# EAGLE schematic Steckverbinder (EAGLE 7.4.0)
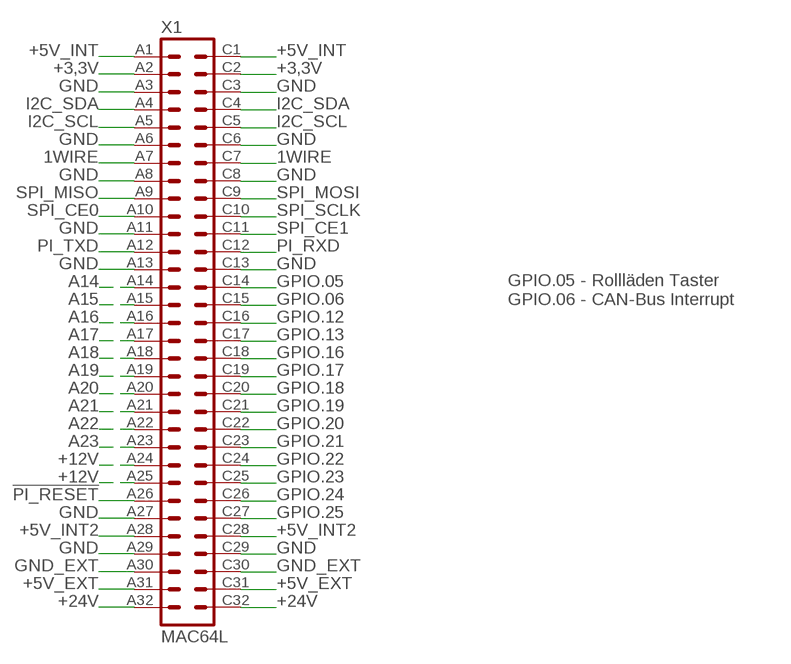
[diagram p0: schematic, sheet 1]

## Parts
X1  MAC64L  [MAC64L]

## Nets
1WIRE: X1.A7 X1.C7
!PI_RESET: X1.A26
+3,3V: X1.A2 X1.C2
+5V_EXT: X1.A31 X1.C31
+5V_INT: X1.A1 X1.C1
+5V_INT2: X1.A28 X1.C28
+12V: X1.A24 X1.A25
+24V: X1.A32 X1.C32
A14: X1.A14
A15: X1.A15
A16: X1.A16
A17: X1.A17
A18: X1.A18
A19: X1.A19
A20: X1.A20
A21: X1.A21
A22: X1.A22
A23: X1.A23
GND: X1.A3 X1.A6 X1.A8 X1.A11 X1.A13 X1.A27 X1.A29 X1.C3 X1.C6 X1.C8 X1.C13 X1.C29
GND_EXT: X1.A30 X1.C30
GPIO.05: X1.C14
GPIO.06: X1.C15
GPIO.12: X1.C16
GPIO.13: X1.C17
GPIO.16: X1.C18
GPIO.17: X1.C19
GPIO.18: X1.C20
GPIO.19: X1.C21
GPIO.20: X1.C22
GPIO.21: X1.C23
GPIO.22: X1.C24
GPIO.23: X1.C25
GPIO.24: X1.C26
GPIO.25: X1.C27
I2C_SCL: X1.A5 X1.C5
I2C_SDA: X1.A4 X1.C4
PI_RXD: X1.C12
PI_TXD: X1.A12
SPI_CE0: X1.A10
SPI_CE1: X1.C11
SPI_MISO: X1.A9
SPI_MOSI: X1.C9
SPI_SCLK: X1.C10

## Notes on the sheet
- GPIO.05 - Rollläden Taster
  GPIO.06 - CAN-Bus Interrupt

## Library data of the parts
X1 = con-vg:MAC64L: CONNECTOR male, 64 pins, block, type C, rows AC, grid 5.08 mm